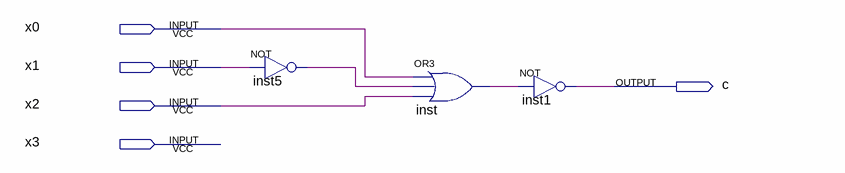
[diagram p0: schematic sheet]
// Quartus schematic Simple_Decoder.bdf as structural Verilog: 3 symbols, 5 pins
module Simple_Decoder (
  input  x0,
  input  x1,
  input  x2,
  input  x3,
  output c
);

  wire inst5_out, inst_out;

  not inst5 (inst5_out, x1);
  or inst (inst_out, x0, inst5_out, x2);
  not inst1 (c, inst_out);
endmodule
